# Altium project patch_antenna_altium.PrjPcb
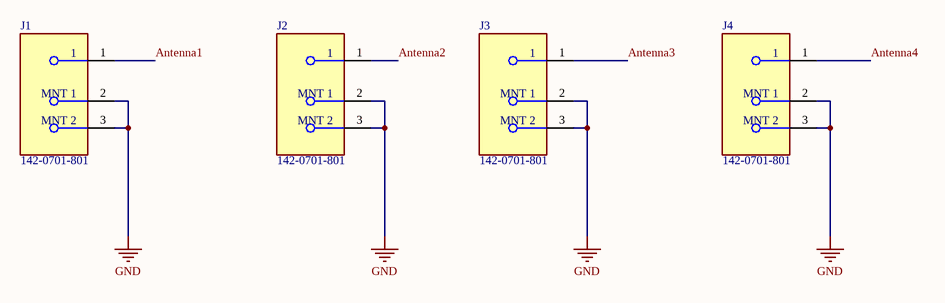
[diagram p0: antenna_array.SchDoc]
1 sheet, 4 parts. Net scope: global (net labels, ports and power ports of the same name join across sheets).
Board file: antenna_array.PcbDoc

## Sheet antenna_array.SchDoc
size A4; SheetNumber: 1; SheetTotal: 1

### Parts
J1  142-0701-801  [FP-142-0701-801-MFG]
J2  142-0701-801  [FP-142-0701-801-MFG]
J3  142-0701-801  [FP-142-0701-801-MFG]
J4  142-0701-801  [FP-142-0701-801-MFG]

### Nets
GND: J1.2(MNT_1) J1.3(MNT_2) J2.2(MNT_1) J2.3(MNT_2) J3.2(MNT_1) J3.3(MNT_2) J4.2(MNT_1) J4.3(MNT_2)
Antenna1: J1.1
Antenna2: J2.1
Antenna3: J3.1
Antenna4: J4.1

### Library data of the parts
J1-J4 = CMP-09588-000002-1: CONN SMA JACK STR 50OHM EDGE MNT; Frequency: 18GHz; Operating Frequency: 0 to 18 GHz; Body Material: Brass; Impedance: 50R; Voltage Rating: 335V; Gender: Female; Body Plating: Gold; Orientation: Straight; Length: 0.44inch; Max Operating Temperature: 165°C; Package Quantity: 5; Packaging: Bulk; Series: SMA; Contact Material: Copper; Min Operating Temperature: -65°C; Depth: 25.58mm; RoHS Compliant: Yes; Case/Package: SMA; Max Frequency: 18GHz; Radiation Hardening: No; Contact Plating: Gold; Mount: Edge; Connector Type: SMA; Fastening Type: Threaded; Termination: Solder